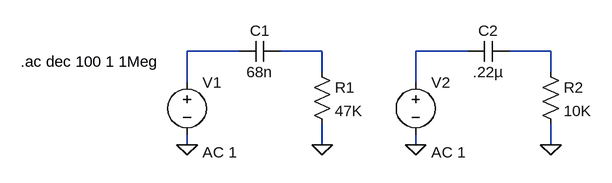
[diagram p0: schematic RC High Pass Filter.asc]
RC High Pass Filter.asc, the LTspice schematic file:
Version 4
SHEET 1 880 680
WIRE 128 112 48 112
WIRE 256 112 192 112
WIRE 480 112 400 112
WIRE 608 112 544 112
WIRE 256 144 256 112
WIRE 608 144 608 112
WIRE 48 160 48 112
WIRE 400 160 400 112
WIRE 48 256 48 240
WIRE 256 256 256 224
WIRE 400 256 400 240
WIRE 608 256 608 224
FLAG 48 256 0
FLAG 256 256 0
FLAG 400 256 0
FLAG 608 256 0
SYMBOL voltage 48 144 R0
WINDOW 123 24 124 Left 2
WINDOW 39 0 0 Left 2
SYMATTR InstName V1
SYMATTR Value ""
SYMATTR Value2 AC 1
SYMBOL cap 192 96 R90
WINDOW 0 0 32 VBottom 2
WINDOW 3 32 32 VTop 2
SYMATTR InstName C1
SYMATTR Value 68n
SYMBOL res 240 128 R0
SYMATTR InstName R1
SYMATTR Value 47K
SYMBOL voltage 400 144 R0
WINDOW 123 24 124 Left 2
WINDOW 39 0 0 Left 2
SYMATTR InstName V2
SYMATTR Value ""
SYMATTR Value2 AC 1
SYMBOL cap 544 96 R90
WINDOW 0 0 32 VBottom 2
WINDOW 3 32 32 VTop 2
SYMATTR InstName C2
SYMATTR Value .22µ
SYMBOL res 592 128 R0
SYMATTR InstName R2
SYMATTR Value 10K
TEXT -208 128 Left 2 !.ac dec 100 1 1Meg

The netlist it stands for:
* RC High Pass Filter.asc
V1 N001 0 AC 1
C1 N002 N001 68n
R1 N002 0 47K
V2 N003 0 AC 1
C2 N004 N003 .22µ
R2 N004 0 10K
.ac dec 100 1 1Meg
.backanno
.end